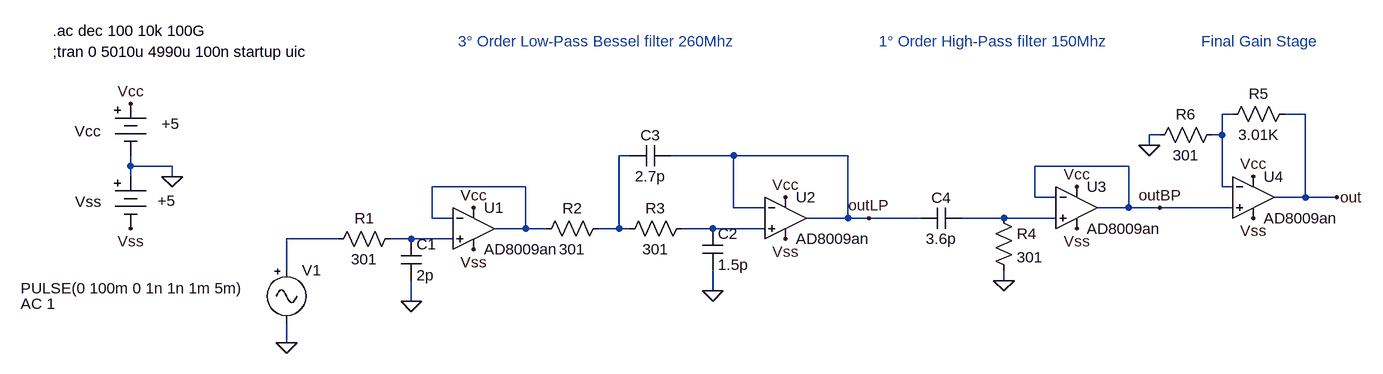
[diagram p0: schematic Real_Sallen-Key_3_LP_Bessel_1_HP.asc]
Real_Sallen-Key_3_LP_Bessel_1_HP.asc, the LTspice schematic file:
Version 4
SHEET 1 1708 680
WIRE 1424 -176 1408 -176
WIRE 1536 -176 1504 -176
WIRE 1312 -144 1296 -144
WIRE 1408 -144 1408 -176
WIRE 1408 -144 1392 -144
WIRE 1296 -128 1296 -144
WIRE 496 -112 480 -112
WIRE 656 -112 560 -112
WIRE 832 -112 656 -112
WIRE -272 -96 -272 -112
WIRE -208 -96 -272 -96
WIRE 1264 -96 1120 -96
WIRE -272 -80 -272 -96
WIRE -208 -80 -208 -96
WIRE 336 -64 192 -64
WIRE 1408 -64 1408 -144
WIRE 1424 -64 1408 -64
WIRE 1120 -48 1120 -96
WIRE 1152 -48 1120 -48
WIRE 1536 -48 1536 -176
WIRE 1536 -48 1488 -48
WIRE 1584 -48 1536 -48
WIRE 656 -32 656 -112
WIRE 704 -32 656 -32
WIRE 1264 -32 1264 -96
WIRE 1264 -32 1216 -32
WIRE 1312 -32 1264 -32
WIRE 1424 -32 1312 -32
WIRE 192 -16 192 -64
WIRE 224 -16 192 -16
WIRE 832 -16 832 -112
WIRE 832 -16 768 -16
WIRE 864 -16 832 -16
WIRE 944 -16 864 -16
WIRE 1072 -16 1008 -16
WIRE 1152 -16 1072 -16
WIRE 336 0 336 -64
WIRE 336 0 288 0
WIRE 368 0 336 0
WIRE 480 0 480 -112
WIRE 480 0 448 0
WIRE 496 0 480 0
WIRE 624 0 576 0
WIRE 704 0 624 0
WIRE 48 16 -32 16
WIRE 160 16 128 16
WIRE 224 16 160 16
WIRE -32 64 -32 16
WIRE 1072 80 1072 64
WIRE 624 96 624 64
WIRE 160 112 160 80
WIRE -32 176 -32 144
FLAG -32 176 0
FLAG 160 112 0
FLAG 624 96 0
FLAG 864 -16 outLP
FLAG 1072 80 0
FLAG 1312 -32 outBP
FLAG -208 -80 0
FLAG -272 -192 Vcc
FLAG -272 0 Vss
FLAG 256 -32 Vcc
FLAG 736 -48 Vcc
FLAG 1184 -64 Vcc
FLAG 256 32 Vss
FLAG 736 16 Vss
FLAG 1184 0 Vss
FLAG 1456 -16 Vss
FLAG 1456 -80 Vcc
FLAG 1296 -128 0
FLAG 1584 -48 out
SYMBOL Misc\\signal -32 48 R0
WINDOW 3 -409 44 Left 2
WINDOW 123 -409 68 Left 2
WINDOW 39 0 0 Left 0
SYMATTR Value PULSE(0 100m 0 1n 1n 1m 5m)
SYMATTR Value2 AC 1
SYMATTR InstName V1
SYMBOL res 144 0 R90
WINDOW 0 0 56 VBottom 2
WINDOW 3 32 56 VTop 2
SYMATTR InstName R1
SYMATTR Value 301
SYMATTR SpiceLine tol=1 pwr=0.1
SYMBOL cap 144 16 R0
SYMATTR InstName C1
SYMATTR Value 2p
SYMATTR SpiceLine V=25 Irms=0 Rser=0 Lser=0 mfg="Murata" pn="GCM0335C1E2R0CA16" type="C0G"
SYMBOL res 464 -16 R90
WINDOW 0 0 56 VBottom 2
WINDOW 3 32 56 VTop 2
SYMATTR InstName R2
SYMATTR Value 301
SYMATTR SpiceLine tol=1 pwr=0.1
SYMBOL res 592 -16 R90
WINDOW 0 0 56 VBottom 2
WINDOW 3 32 56 VTop 2
SYMATTR InstName R3
SYMATTR Value 301
SYMATTR SpiceLine tol=1 pwr=0.1
SYMBOL cap 608 0 R0
SYMATTR InstName C2
SYMATTR Value 1.5p
SYMATTR SpiceLine V=25 Irms=0 Rser=0 Lser=0 mfg="Murata" pn="GRM0335C1E1R5CA01" type="C0G"
SYMBOL cap 560 -128 R90
WINDOW 0 0 32 VBottom 2
WINDOW 3 32 32 VTop 2
SYMATTR InstName C3
SYMATTR Value 2.7p
SYMATTR SpiceLine V=25 Irms=0 Rser=0 Lser=0 mfg="Murata" pn="GCM0335C1E2R7CA16" type="C0G"
SYMBOL cap 1008 -32 R90
WINDOW 0 0 32 VBottom 2
WINDOW 3 32 32 VTop 2
SYMATTR InstName C4
SYMATTR Value 3.6p
SYMATTR SpiceLine V=25 Irms=0 Rser=0 Lser=0 mfg="Murata" pn="GRM0335C1E3R6CA01" type="C0G"
SYMBOL res 1056 -32 R0
SYMATTR InstName R4
SYMATTR Value 301
SYMATTR SpiceLine tol=1 pwr=0.1
SYMBOL Misc\\battery -272 -208 R0
WINDOW 0 -86 58 Left 2
WINDOW 3 48 47 Left 2
WINDOW 123 0 0 Left 0
WINDOW 39 0 0 Left 0
SYMATTR InstName Vcc
SYMATTR Value +5
SYMBOL Misc\\battery -272 -96 R0
WINDOW 0 -85 55 Left 2
WINDOW 3 42 53 Left 2
WINDOW 123 0 0 Left 0
WINDOW 39 0 0 Left 0
SYMATTR InstName Vss
SYMATTR Value +5
SYMBOL AutoGenerated\\AD8009an 256 0 R0
SYMATTR InstName U1
SYMBOL AutoGenerated\\AD8009an 736 -16 R0
SYMATTR InstName U2
SYMBOL AutoGenerated\\AD8009an 1184 -32 R0
SYMATTR InstName U3
SYMBOL AutoGenerated\\AD8009an 1456 -48 R0
SYMATTR InstName U4
SYMBOL res 1520 -192 R90
WINDOW 0 0 56 VBottom 2
WINDOW 3 32 56 VTop 2
SYMATTR InstName R5
SYMATTR Value 3.01K
SYMATTR SpiceLine tol=1 pwr=0.1
SYMBOL res 1408 -160 R90
WINDOW 0 0 56 VBottom 2
WINDOW 3 32 56 VTop 2
SYMATTR InstName R6
SYMATTR Value 301
SYMATTR SpiceLine tol=1 pwr=0.1
TEXT -392 -304 Left 2 !.ac dec 100 10k 100G
TEXT -392 -272 Left 2 !;tran 0 5010u 4990u 100n startup uic
TEXT 232 -288 Left 2 ;3° Order Low-Pass Bessel filter 260Mhz
TEXT 880 -288 Left 2 ;1° Order High-Pass filter 150Mhz
TEXT 1376 -288 Left 2 ;Final Gain Stage

The netlist it stands for:
* Real_Sallen-Key_3_LP_Bessel_1_HP.asc
V1 N006 0 PULSE(0 100m 0 1n 1n 1m 5m) AC 1
R1 N007 N006 301 tol=1 pwr=0.1
C1 N007 0 2p V=25 Irms=0 Rser=0 Lser=0 mfg="Murata" pn="GCM0335C1E2R0CA16" type="C0G"
R2 N002 N003 301 tol=1 pwr=0.1
R3 N005 N002 301 tol=1 pwr=0.1
C2 N005 0 1.5p V=25 Irms=0 Rser=0 Lser=0 mfg="Murata" pn="GRM0335C1E1R5CA01" type="C0G"
C3 outLP N002 2.7p V=25 Irms=0 Rser=0 Lser=0 mfg="Murata" pn="GCM0335C1E2R7CA16" type="C0G"
C4 N004 outLP 3.6p V=25 Irms=0 Rser=0 Lser=0 mfg="Murata" pn="GRM0335C1E3R6CA01" type="C0G"
R4 N004 0 301 tol=1 pwr=0.1
Vcc Vcc 0 +5
Vss 0 Vss +5
* U1: AD8009an (symbol AutoGenerated\AD8009an not available, pins judged from their places): In+=N007 In-=N003 V+=Vcc V-=Vss OUT=N003
* U2: AD8009an (symbol AutoGenerated\AD8009an not available, pins judged from their places): In+=N005 In-=outLP V+=Vcc V-=Vss OUT=outLP
* U3: AD8009an (symbol AutoGenerated\AD8009an not available, pins judged from their places): In+=N004 In-=outBP V+=Vcc V-=Vss OUT=outBP
* U4: AD8009an (symbol AutoGenerated\AD8009an not available, pins judged from their places): In+=outBP In-=N001 V+=Vcc V-=Vss OUT=out
R5 out N001 3.01K tol=1 pwr=0.1
R6 N001 0 301 tol=1 pwr=0.1
.ac dec 100 10k 100G
;tran 0 5010u 4990u 100n startup uic
* 3° Order Low-Pass Bessel filter 260Mhz
* 1° Order High-Pass filter 150Mhz
* Final Gain Stage
.backanno
.end